# Altium project recall_discrete_v0_1.PrjPcb
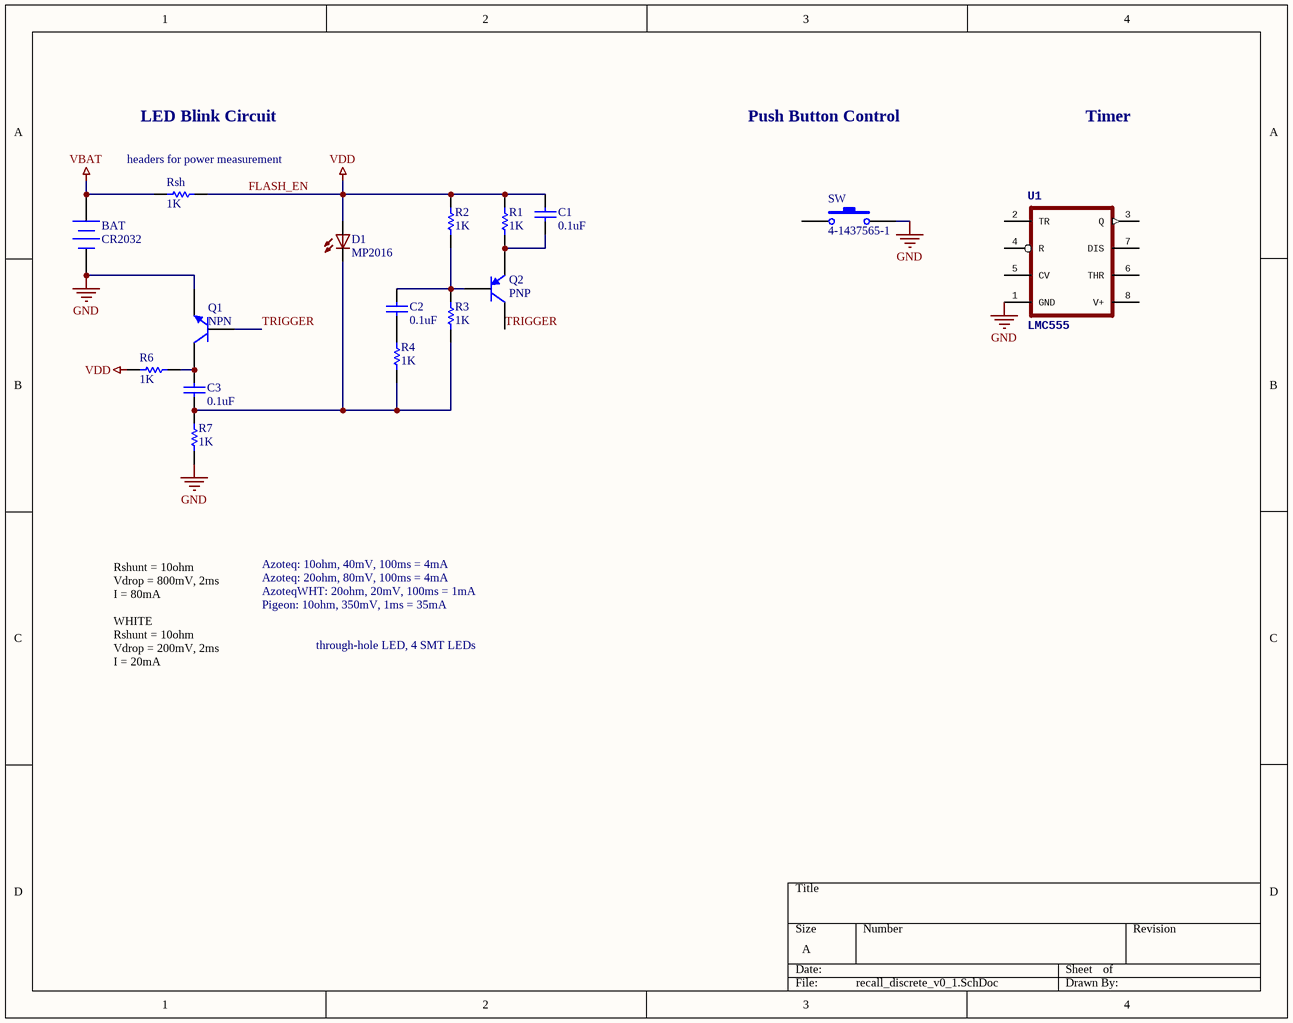
[diagram p0: recall_discrete_v0_1.SchDoc]
1 sheet, 16 parts. Net scope: global (net labels, ports and power ports of the same name join across sheets).
Board file: recall_discrete_v0_1.PcbDoc

## Sheet recall_discrete_v0_1.SchDoc
size A

### Parts
BAT  CR2032  [BAT-HLD-001]
C1  value 0.1uF  [CAP_0402R]  (hidden comment: CAP)
C2  value 0.1uF  [CAP_0402R]  (hidden comment: CAP)
C3  value 0.1uF  [CAP_0402R]  (hidden comment: CAP)
D1  MP2016  [MP2016_centered]
Q1  NPN  [SOT-23]
Q2  PNP  [SOT-23]
R1  value 1K  [RES_0402]  (hidden comment: RES)
R2  value 1K  [RES_0402]  (hidden comment: RES)
R3  value 1K  [RES_0402]  (hidden comment: RES)
R4  value 1K  [RES_0402]  (hidden comment: RES)
R6  value 1K  [RES_0402]  (hidden comment: RES)
R7  value 1K  [RES_0402]  (hidden comment: RES)
Rsh  value 1K  [RES_0402]  (hidden comment: RES)
SW  4-1437565-1  [4-1437565-1]
U1  LMC555  [SOIC-8]

### Nets
FLASH_EN: C1.2 D1.A R1.2 R2.2 R6.2 Rsh.1  [also labelled VDD]
GND: BAT.2(-) Q1.2(E) R7.1 SW.2 U1.1(GND)
VBAT: BAT.1(+) Rsh.2
TRIGGER: Q1.1(B) Q2.3(C)
NetC1_1: C1.1 Q2.2(E) R1.1
NetC2_1: C2.1 Q2.1(B) R2.1 R3.2
NetC2_2: C2.2 R4.2
NetC3_1: C3.1 D1.C R3.1 R4.1 R7.2
NetC3_2: C3.2 Q1.3(C) R6.1

Not connected (* = marked no-connect by the designer): SW 1; U1 2(TR) 3(Q) 4(R) 5(CV) 6(THR) 7(DIS) 8(V+)

### Notes on the sheet
- (near Rsh) headers for power measurement
- LED Blink Circuit
- Push Button Control
- Timer
- Azoteq: 10ohm, 40mV, 100ms = 4mA
- Azoteq: 20ohm, 80mV, 100ms = 4mA
- Pigeon: 10ohm, 350mV, 1ms = 35mA
- AzoteqWHT: 20ohm, 20mV, 100ms = 1mA
- through-hole LED, 4 SMT LEDs
- Rshunt = 10ohm
  Vdrop = 800mV, 2ms
  I = 80mA
  WHITE
  Rshunt = 10ohm
  Vdrop = 200mV, 2ms
  I = 20mA

### Library data of the parts
BAT = Battery: Published: 24-Mar-1999; LatestRevisionDate: 17-Jul-2002; LatestRevisionNote: Re-released for DXP Platform.; PackageReference: BAT-2; Publisher: Altium Limited; PackageDescription: Battery; 2 Leads
C1-C3 = CAP: Capacitor; Published: 8-Jun-2000; LatestRevisionDate: 29-May-2009; LatestRevisionNote: IPC-7351 Footprint Added.; PackageReference: C1206; Publisher: Altium Limited; PackageDescription: Chip Capacitor
D1 = MP2016: MP2016 White LED
Q1 = NPN: NPN General Purpose Transistor, 2N3904, MMBT2222AL; Published: 8-Jun-2000; LatestRevisionDate: 15-Jan-2003; LatestRevisionNote: PCB Footprint 'BCY-W3/D4.7' replaced; DatasheetVersion: 1997; PackageVersion: Sep-1998; PackageReference: TO-92A; Publisher: Altium Limited; PackageDescription: TO, Flat Index; 3 In-Line, Axial Leads; Body Dia. 4.5mm; Leads 0.51 x 0.48 mm (max); ComponentLink1Description: Manufacturer Link; ComponentLink1URL: http://www.fairchildsemi.com/; ComponentLink2Description: Datasheet; ComponentLink2URL: http://www.fairchildsemi.com/ds/2N%2F2N3904.pdf
Q2 = PNP: PNP General Purpose Transistor, 2N3906, MMBT2907AL; Published: 8-Jun-2000; LatestRevisionDate: 15-Jan-2003; LatestRevisionNote: PCB Footprint 'BCY-W3/D4.7' replaced; DatasheetVersion: 1997; PackageVersion: Sep-1998; PackageReference: TO-92A; Publisher: Altium Limited; PackageDescription: TO, Flat Index; 3 In-Line, Axial Leads; Body Dia. 4.5mm; Leads 0.51 x 0.48 mm (max); ComponentLink1Description: Manufacturer Link; ComponentLink1URL: http://www.fairchildsemi.com/; ComponentLink2Description: Datasheet; ComponentLink2URL: http://www.fairchildsemi.com/ds/2N%2F2N3906.pdf
R1-R4 R6 R7 Rsh = RES: Resistor; Published: 8-Jun-2000; LatestRevisionDate: 17-Jul-2002; LatestRevisionNote: Re-released for DXP Platform.; PackageReference: AXIAL-0.3; Publisher: Altium Limited; PackageDescription: Axial Device, Thru-Hole; 2 Leads; 0.3 in Pin Spacing
SW = SW-TACT: Translucent Conductive Silicone Elastomer Switch; Published: 24-Mar-1999; LatestRevisionDate: 17-Jul-2002; LatestRevisionNote: Re-released for DXP Platform.; PackageReference: SPST-2; Publisher: Altium Limited; PackageDescription: Switch; 2 Leads